# Altium schematic sheet gas-sensor.SchDoc: Gas Sensor Analog Front End
size B
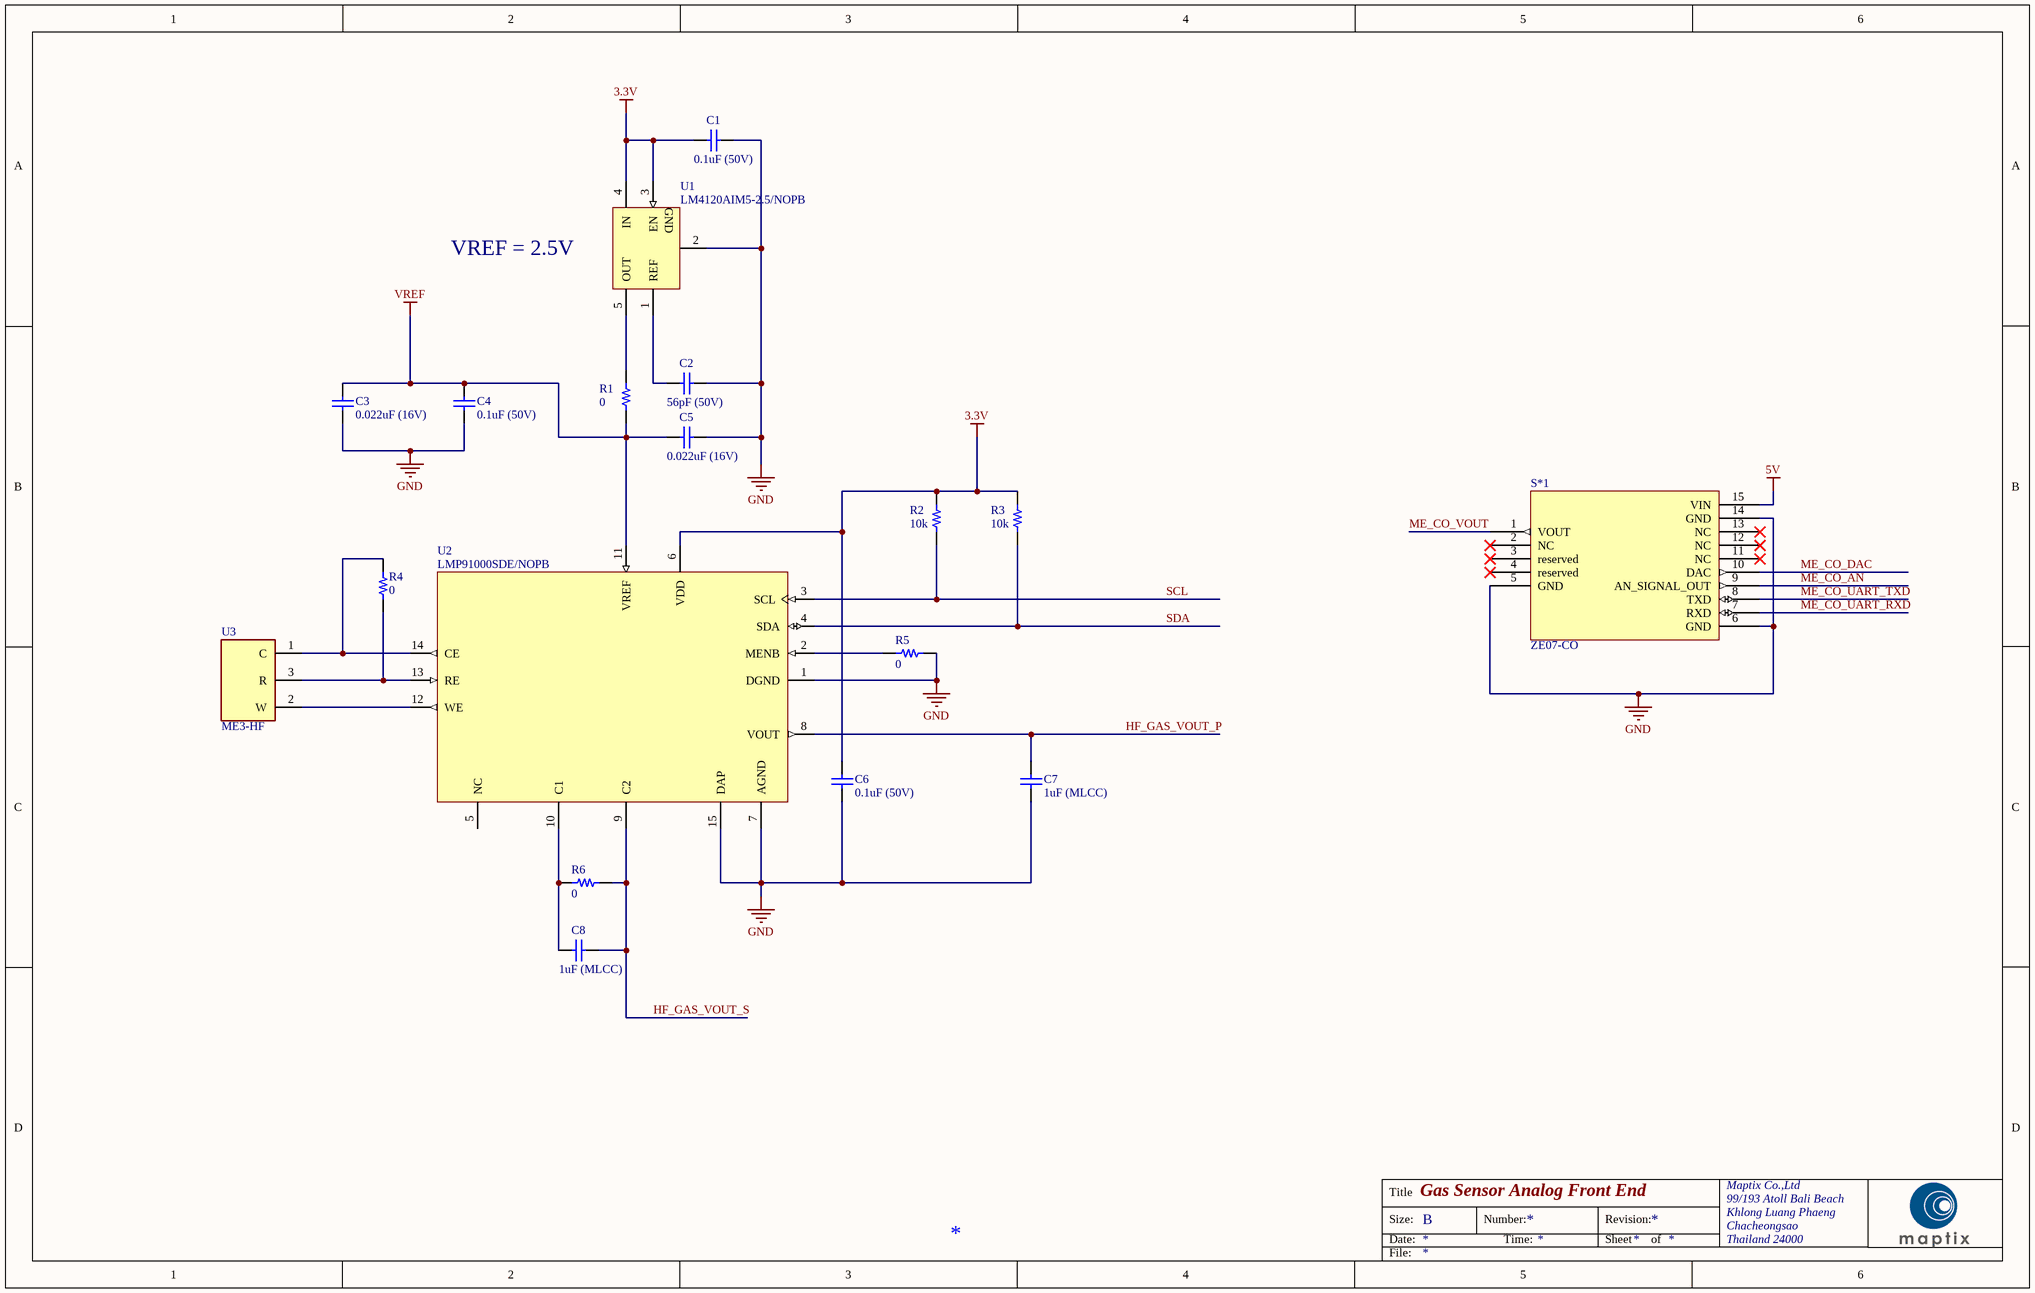
[diagram p0: gas-sensor.SchDoc]

## Parts
C1  0.1uF (50V)  [CAPC1608X95X40NL15T15]
C2  56pF (50V)  [CAPC1608X95X40NL15T15]
C3  0.022uF (16V)  [CAPC1608X95X40NL15T15]
C4  0.1uF (50V)  [CAPC1608X95X40NL15T15]
C5  0.022uF (16V)  [CAPC1608X95X40NL15T15]
C6  0.1uF (50V)  [CAPC1608X95X40NL15T15]
C7  1uF (MLCC)  [CAPC1608X95X40NL15T15]
C8  1uF (MLCC)  [CAPC1608X95X40NL15T15]
R1  0  [RES 0603_1608]
R2  10k  [RES 0603_1608]
R3  10k  [RES 0603_1608]
R4  0  [RES 0603_1608]
R5  0  [RES 0603_1608]
R6  0  [RES 0603_1608]
S*1  ZE07-CO  [ZE07-CO]
U1  LM4120AIM5-2.5/NOPB  [MF05A_M]
U2  LMP91000SDE/NOPB  [NHL0014B_V_Pae]
U3  ME3-HF  [ME3SO2]

## Nets
3.3V: C1.2 C6.2 R2.2 R3.2 U1.3(EN) U1.4(IN) U2.6(VDD)
5V: S*1.15(VIN)
GND: C1.1 C2.1 C3.2 C4.1 C5.1 C6.1 C7.2 R5.1 S*1.5(GND) S*1.6(GND) S*1.14(GND) U1.2(GND) U2.1(DGND) U2.7(AGND) U2.15(DAP)
VREF: C3.1 C4.2 C5.2 R1.1 U2.11(VREF)
HF_GAS_VOUT_P: C7.1 U2.8(VOUT)
HF_GAS_VOUT_S: C8.1 R6.1 U2.9(C2)
ME_CO_AN: S*1.9(AN_SIGNAL_OUT)
ME_CO_DAC: S*1.10(DAC)
ME_CO_UART_RXD: S*1.7(RXD)
ME_CO_UART_TXD: S*1.8(TXD)
ME_CO_VOUT: S*1.1(VOUT)
SCL: R2.1 U2.3(SCL)
SDA: R3.1 U2.4(SDA)
NetC2_2: C2.2 U1.1(REF)
NetC8_2: C8.2 R6.2 U2.10(C1)
NetR1_2: R1.2 U1.5(OUT)
NetR4_1: R4.1 U2.14(CE) U3.1(C)
NetR4_2: R4.2 U2.13(RE) U3.3(R)
NetR5_2: R5.2 U2.2(MENB)
NetU2_12: U2.12(WE) U3.2(W)

Not connected (* = marked no-connect by the designer): S*1 2(NC)* 3(reserved)* 4(reserved)* 11(NC)* 12(NC)* 13(NC)*; U2 5(NC)

## Notes on the sheet
- VREF = 2.5V
- Title
- Size:
- Date:
- B
- Number:
- Time:
- Revision:
- Sheet
- of
- Maptix Co.,Ltd
- 99/193 Atoll Bali Beach
- Khlong Luang Phaeng
- Chacheongsao
- Thailand 24000
- File:

## Library data of the parts
C1-C8 = CMP-2006-00072-1: Part Number: VJ0603Y332JXACW1BC; Manufacturer: Vitramon
R1-R6 = CRCW060329K4FKEA: Resistor; Manufacturer: Vishay Dale; Power (Watts): 0.1W, 1/10W; Resistance: 29.4 kOhms; Temperature Coefficient: ±100ppm/°C; Tolerance: ±1%; Part Number: CRCW060329K4FKEA; ComponentLink1Description: Datasheet; ComponentLink1URL: http://www.vishay.com/docs/20035/dcrcwe3.pdf; ComponentLink2Description: DigiKey Link; ComponentLink2URL: http://digikey.com/product-detail/en/vishay-dale/CRCW060329K4FKEA/541-29.4KHCT-ND/1179975; Composition: Thick Film; Device Package: 0603 (1608 Metric); Features: Automotive AEC-Q200; Height - Seated (Max): 0.020" (0.50mm); LastUpdated: 1/2/2020 12:06:58 AM; Lifecycle Status: Active; Minimum Order: 1; Number of Terminations: 2; Operating Temperature: -55°C ~ 155°C; Package / Case: 0603 (1608 Metric); Packaging: TapeAndReel; PartId: 7975; Part Status: Active; Price: 0.00; Ratings: AEC-Q200; Series: CRCW; Size / Dimension: 0.061" L x 0.033" W (1.55mm x 0.85mm); Supplier 1: DigiKey; Supplier Part Number 1: 541-29.4KHCT-ND; Supplier Device Package: 0603
  R1 R4-R6: Value: 0
  R2 R3: Value: 10k
U1 = CMP-0074-00248-2: Precision Micropower Low Dropout Voltage Reference, 5-pin SOT-23, Pb-Free; Manufacturer: National Semiconductor; PowerWise: Y; CompType: Voltage Reference IC; PackageTopMarking: R08A*XTT; PackageVersion: revD, Aug-2008; ComponentLink1Description: LM4120 Datasheet; ComponentLink3Description: MF05A Package Page; DatasheetVersion: Mar-2005; ComponentLink2Description: LM4120 Web Page; PinCount: 5; RevisionNote: Component URLs added; PackageDescription: Molded SOT-23, .115 x .063 x .040 in Body, 5 Lead, .0375 in Pitch; PackageReference: MF05A; RoHS: Y; ComponentLink2URL: http://www.national.com/pf/LM/LM4120.html; ComponentLink3URL: http://www.national.com/packaging/folders/mf05a.html; ComponentLink1URL: http://www.national.com/ds/LM/LM4120.pdf
U2 = CMP-0064-00201-2: Configurable AFE Potentiostat for Low-Power Chemical Sensing Applications, 14-pin LLP, 250 Reel; Manufacturer: Texas Instruments; PowerWise: N; PackageTopMarking: NS*UZXYTT*L91000; CompType: OtherParts; PackageDescription: LLP, Plastic, Dual, 4 x 4 x 0.8mm Body, 14 Lead, 0.5mm Pitch, No Pullback; ComponentLink1URL: http://www.ti.com/general/docs/lit/getliterature.tsp?genericPartNumber=LMP91000&fileType=pdf; ComponentLink1Description: Datasheet URL; PinCount: 14; RoHS: Y; PackageReference: NHL0014B
U3 = ME3-SO2: Undefined or Miscellaneous; Manufacturer_Name: WINSEN; Datasheet Link: http://www.eleparts.co.kr/data/goods_old/design/product_file/SENSOR/gas/ME3-SO2%200-20ppm(ver1.2)%20Manual.pdf; Height: 16.4mm; Manufacturer_Part_Number: ME3-SO2